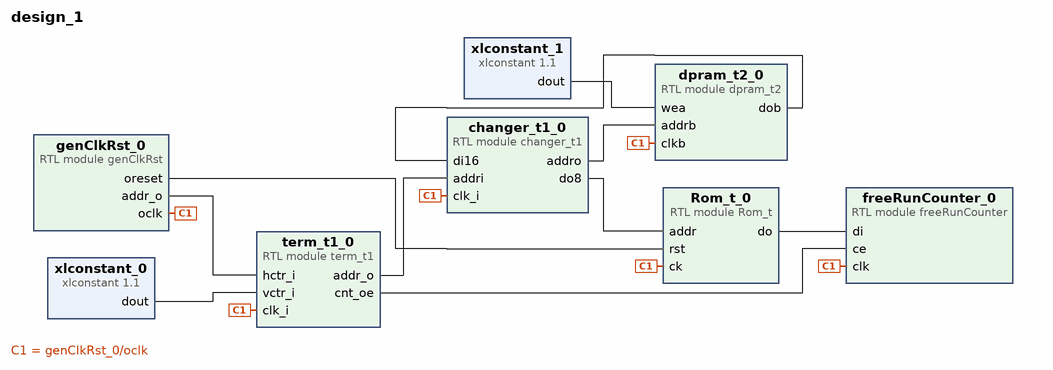
[diagram p0: block diagram of the top level]
# Vivado block design design_1, xc7a100tcsg324-1, Vivado 2019.2
create_bd_design design_1

create_bd_cell -type module -reference Rom_t Rom_t_0
create_bd_cell -type ip -vlnv xilinx.com:ip:xlconstant:1.1 xlconstant_0
set_property -dict {CONFIG.CONST_VAL 2 CONFIG.CONST_WIDTH 12} [get_bd_cells xlconstant_0]
create_bd_cell -type ip -vlnv xilinx.com:ip:xlconstant:1.1 xlconstant_1
create_bd_cell -type module -reference genClkRst genClkRst_0
create_bd_cell -type module -reference dpram_t2 dpram_t2_0
create_bd_cell -type module -reference changer_t1 changer_t1_0
create_bd_cell -type module -reference freeRunCounter freeRunCounter_0
create_bd_cell -type module -reference term_t1 term_t1_0

# ---- connections ----

connect_bd_net [get_bd_pins genClkRst_0/oclk] \
  [get_bd_pins Rom_t_0/ck] [get_bd_pins dpram_t2_0/clkb] [get_bd_pins changer_t1_0/clk_i] [get_bd_pins freeRunCounter_0/clk] \
  [get_bd_pins term_t1_0/clk_i]
connect_bd_net [get_bd_pins genClkRst_0/addr_o] [get_bd_pins term_t1_0/hctr_i]
connect_bd_net [get_bd_pins dpram_t2_0/dob] [get_bd_pins changer_t1_0/di16]
connect_bd_net [get_bd_pins term_t1_0/addr_o] [get_bd_pins changer_t1_0/addri]
connect_bd_net [get_bd_pins term_t1_0/cnt_oe] [get_bd_pins freeRunCounter_0/ce]
connect_bd_net [get_bd_pins changer_t1_0/addro] [get_bd_pins dpram_t2_0/addrb]
connect_bd_net [get_bd_pins genClkRst_0/oreset] [get_bd_pins Rom_t_0/rst]
connect_bd_net [get_bd_pins Rom_t_0/do] [get_bd_pins freeRunCounter_0/di]
connect_bd_net [get_bd_pins changer_t1_0/do8] [get_bd_pins Rom_t_0/addr]
connect_bd_net [get_bd_pins xlconstant_0/dout] [get_bd_pins term_t1_0/vctr_i]
connect_bd_net [get_bd_pins xlconstant_1/dout] [get_bd_pins dpram_t2_0/wea]

validate_bd_design
save_bd_design
